# Altium schematic sheet SolderIronTemp.SchDoc
size A4; SheetNumber: 2; SheetTotal: 4
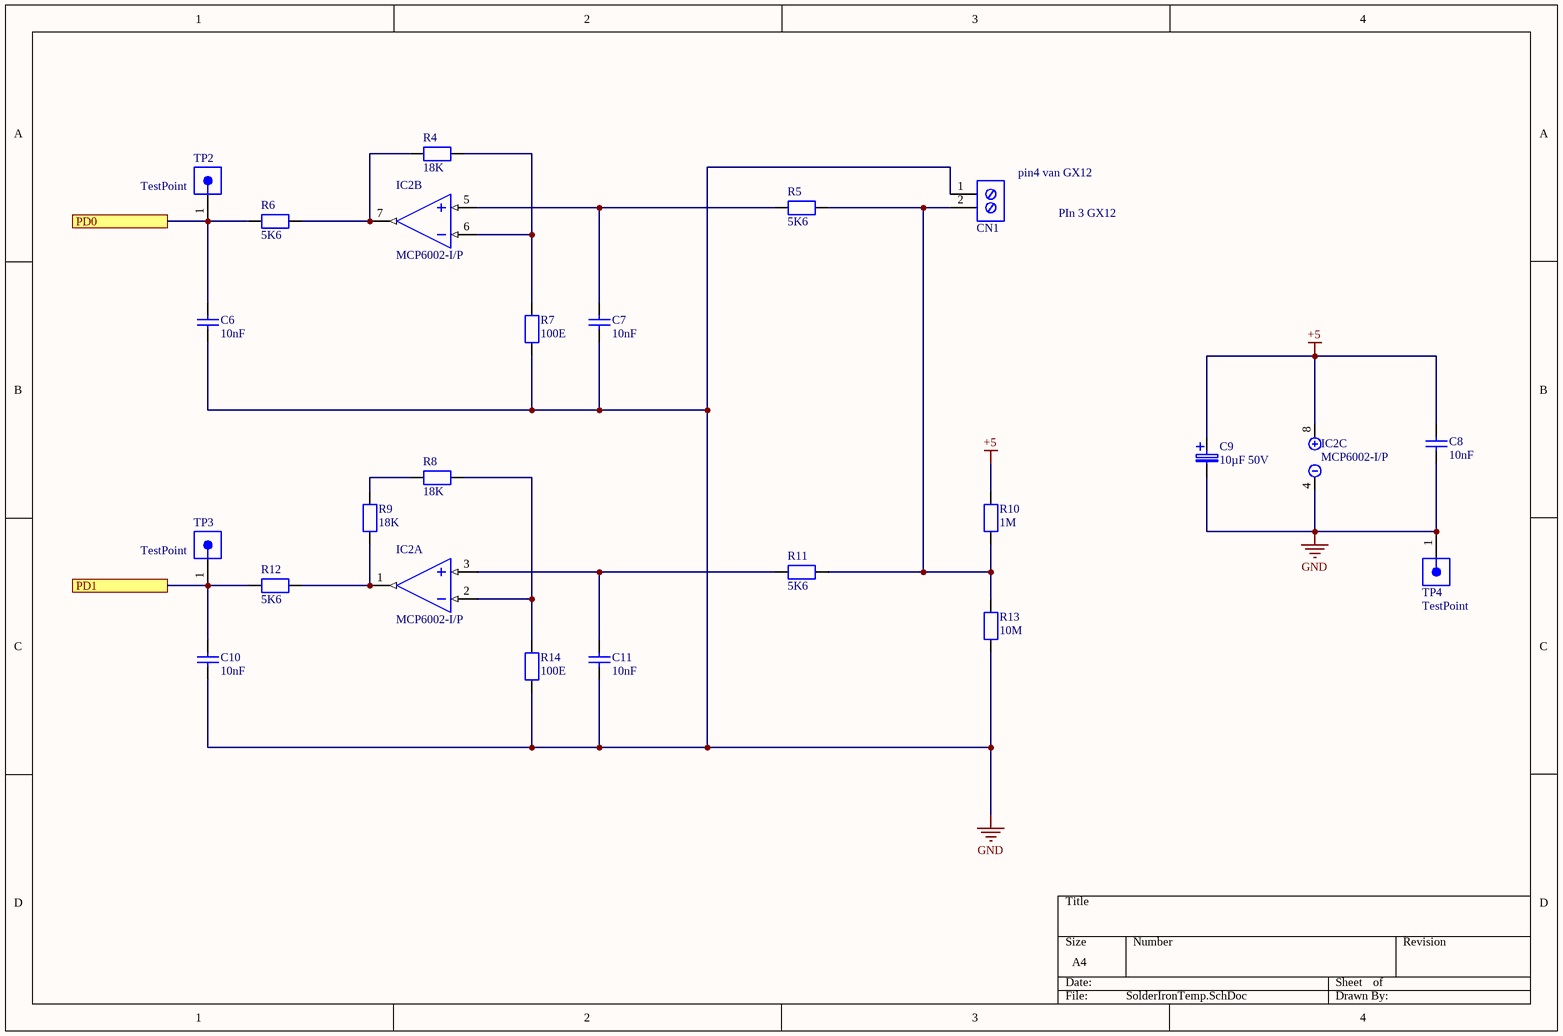
[diagram p0: SolderIronTemp.SchDoc]

## Parts
C6  10nF  [CAPC2012X88N]
C7  10nF  [CAPC2012X88N]
C8  10nF  [CAPC2012X88N]
C9  10µF 50V  [TAP106M050BRW]
C10  10nF  [CAPC2012X88N]
C11  10nF  [CAPC2012X88N]
CN1  Printkroonsteen 2 POL  [Printkroonsteen 2pin]  (value not drawn)
IC2  MCP6002-I/P  [PDIP300-P8]  (parts A,B,C of 3)
R4  18K  [RESC2012X50N]
R5  5K6  [RESC2012X50N]
R6  5K6  [RESC2012X50N]
R7  100E  [RESC2012X50N]
R8  18K  [RESC2012X50N]
R9  18K  [RESC2012X50N]
R10  1M  [RESC2012X50N]
R11  5K6  [RESC2012X50N]
R12  5K6  [RESC2012X50N]
R13  10M  [RESC2012X50N]
R14  100E  [RESC2012X50N]
TP2  TestPoint  [61300111121]
TP3  TestPoint  [61300111121]
TP4  TestPoint  [61300111121]

## Ports
PD0 (see CPU[3B]), PD1 (see CPU[3B])

## Nets
+5: C8.2 C9.1 IC2.8 R10.2
GND: C6.1 C7.1 C8.1 C9.2 C10.1 C11.1 CN1.1 IC2.4 R7.1 R13.1 R14.1 TP4.1
PD0: C6.2 R6.1 TP2.1 ; port PD0
PD1: C10.2 R12.1 TP3.1 ; port PD1
NetC7_2: C7.2 IC2.5(VINB+) R5.1
NetC11_2: C11.2 IC2.3(VINA+) R11.1
NetCN1_2: CN1.2 R5.2 R10.1 R11.2 R13.2
NetIC2_1: IC2.1(VOUTA) R9.1 R12.2
NetIC2_2: IC2.2(VINA-) R8.2 R14.2
NetIC2_6: IC2.6(VINB-) R4.2 R7.2
NetIC2_7: IC2.7(VOUTB) R4.1 R6.2
NetR8_1: R8.1 R9.2

## Notes on the sheet
- (near CN1) pin4 van GX12
- PIn 3 GX12

## Library data of the parts
C6-C8 C10 C11 = Capacitor ceramic 0805: Manufacturer: Kemet; Part Number: C0402C104K4RACTU
C9 = capacitor THT radial tantalum: Tantalum Capacitors - Solid Leaded 50V 10uF 20% ESR=1.6 Ohm TAP106M050BRW; Manufacturer_Name: Kyocera AVX; Geometry.Height: 15.5mm; Mouser Part Number: 581-TAP106M050BRW; Mouser Price/Stock: https://www.mouser.co.uk/ProductDetail/AVX/TAP106M050BRW?qs=GjEaAqXp9rZGx11KfVU76g%3D%3D; Manufacturer_Part_Number: TAP106M050BRW; Datasheet Link: https://www.mouser.be/datasheet/2/40/tap-776819.pdf
CN1 = printkroonsteen 1 X 2: Printkroonsteen 2 PO L1716020000; Manufacturer_Name: Weidmuller; Datasheet Link: https://catalog.weidmueller.com/catalog/Start.do?ObjectID=1716020000&_ga=2.21797499.1716783809.1613378202-511725545.1613378202; Manufacturer_Part_Number: 1716020000; Mouser Part Number: 470-1716020000; Mouser Price/Stock: https://www.mouser.co.uk/ProductDetail/Weidmuller/1716020000?qs=WJDKaGZ8K%252B7GSEFQgvMjVA%3D%3D
IC2 = CMP-0187-00119-3: Dual opamp; Max Frequency: 1kHz; Operating Supply Current: 100uA; Amplifier Type: GENERAL PURPOSE; Number of Channels: 2; Power Supply Rejection Ratio (PSRR): 86dB; Max Input Voltage: 6V; Bandwidth: 1MHz; Voltage Gain: 112dB; Input Bias Current: 1pA; Slew Rate-Nom: 0.6V/µs; Output Current: 23mA; Input Offset Voltage-Max: 4.5mV; Common Mode Rejection Ratio: 60dB; Min Input Voltage: 1.8V; Operating Supply Voltage: 5.5V; Height: 0.195inch; Number of Circuits: 2; REACH SVHC: No SVHC; Max Supply Voltage: 6V; Supply Current: 100uA; Gain Bandwidth Product: 1MHz; Radiation Hardening: No; Mount: Through Hole; Length: 0.4inch; Number of Pins: 8; Min Operating Temperature: -40°C; Case/Package: PDIP; Number of Amplifiers: 2; RoHS Compliant: Yes; Lead Free: Lead Free; Number of Elements: 2; Technology: CMOS; Width: 0.28inch; Slew Rate: 0.6V/µs; Packaging: Rail/Tube; Output Current per Channel: 23mA; Max Operating Temperature: 85°C; Nominal Supply Current: 100uA; Min Supply Voltage: 1.8V; Input Offset Voltage (Vos): 4.5mV; Unity Gain Bandwidth Product: 1MHz; Package Quantity: 60
R4-R14 = resistor 0805: Manufacturer: Vishay Dale; Part Number: CRCW08050000Z0EA
TP2-TP4 = TestPoint: NexarPartId: 32855518; Operating Supply Voltage: 250V; Connector Type: Male Pin; Contact Resistance: 20mΩ; Number of Contacts: 1; Gender: Male; Current Rating: 3A; Contact Mating Length: 5.9944mm; Number of Pins: 1; Lead Pitch: 2.54mm; Contact Plating: Gold; RoHS: Compliant; Termination: Solder; Mount: Through Hole; Number of Rows: 1; Orientation: Vertical; Contact Material: Copper; Packaging: Bulk; REACH SVHC: Unknown; Number of Positions: 1; Color: Black